# EAGLE schematic Domino Pi No Teardrop (EAGLE 6.5.0)
Domino breakout Board
DATABASE: ./../Common/BOM/Domino_DB.txt; DRAWN: M.STEMPIN; REV: A
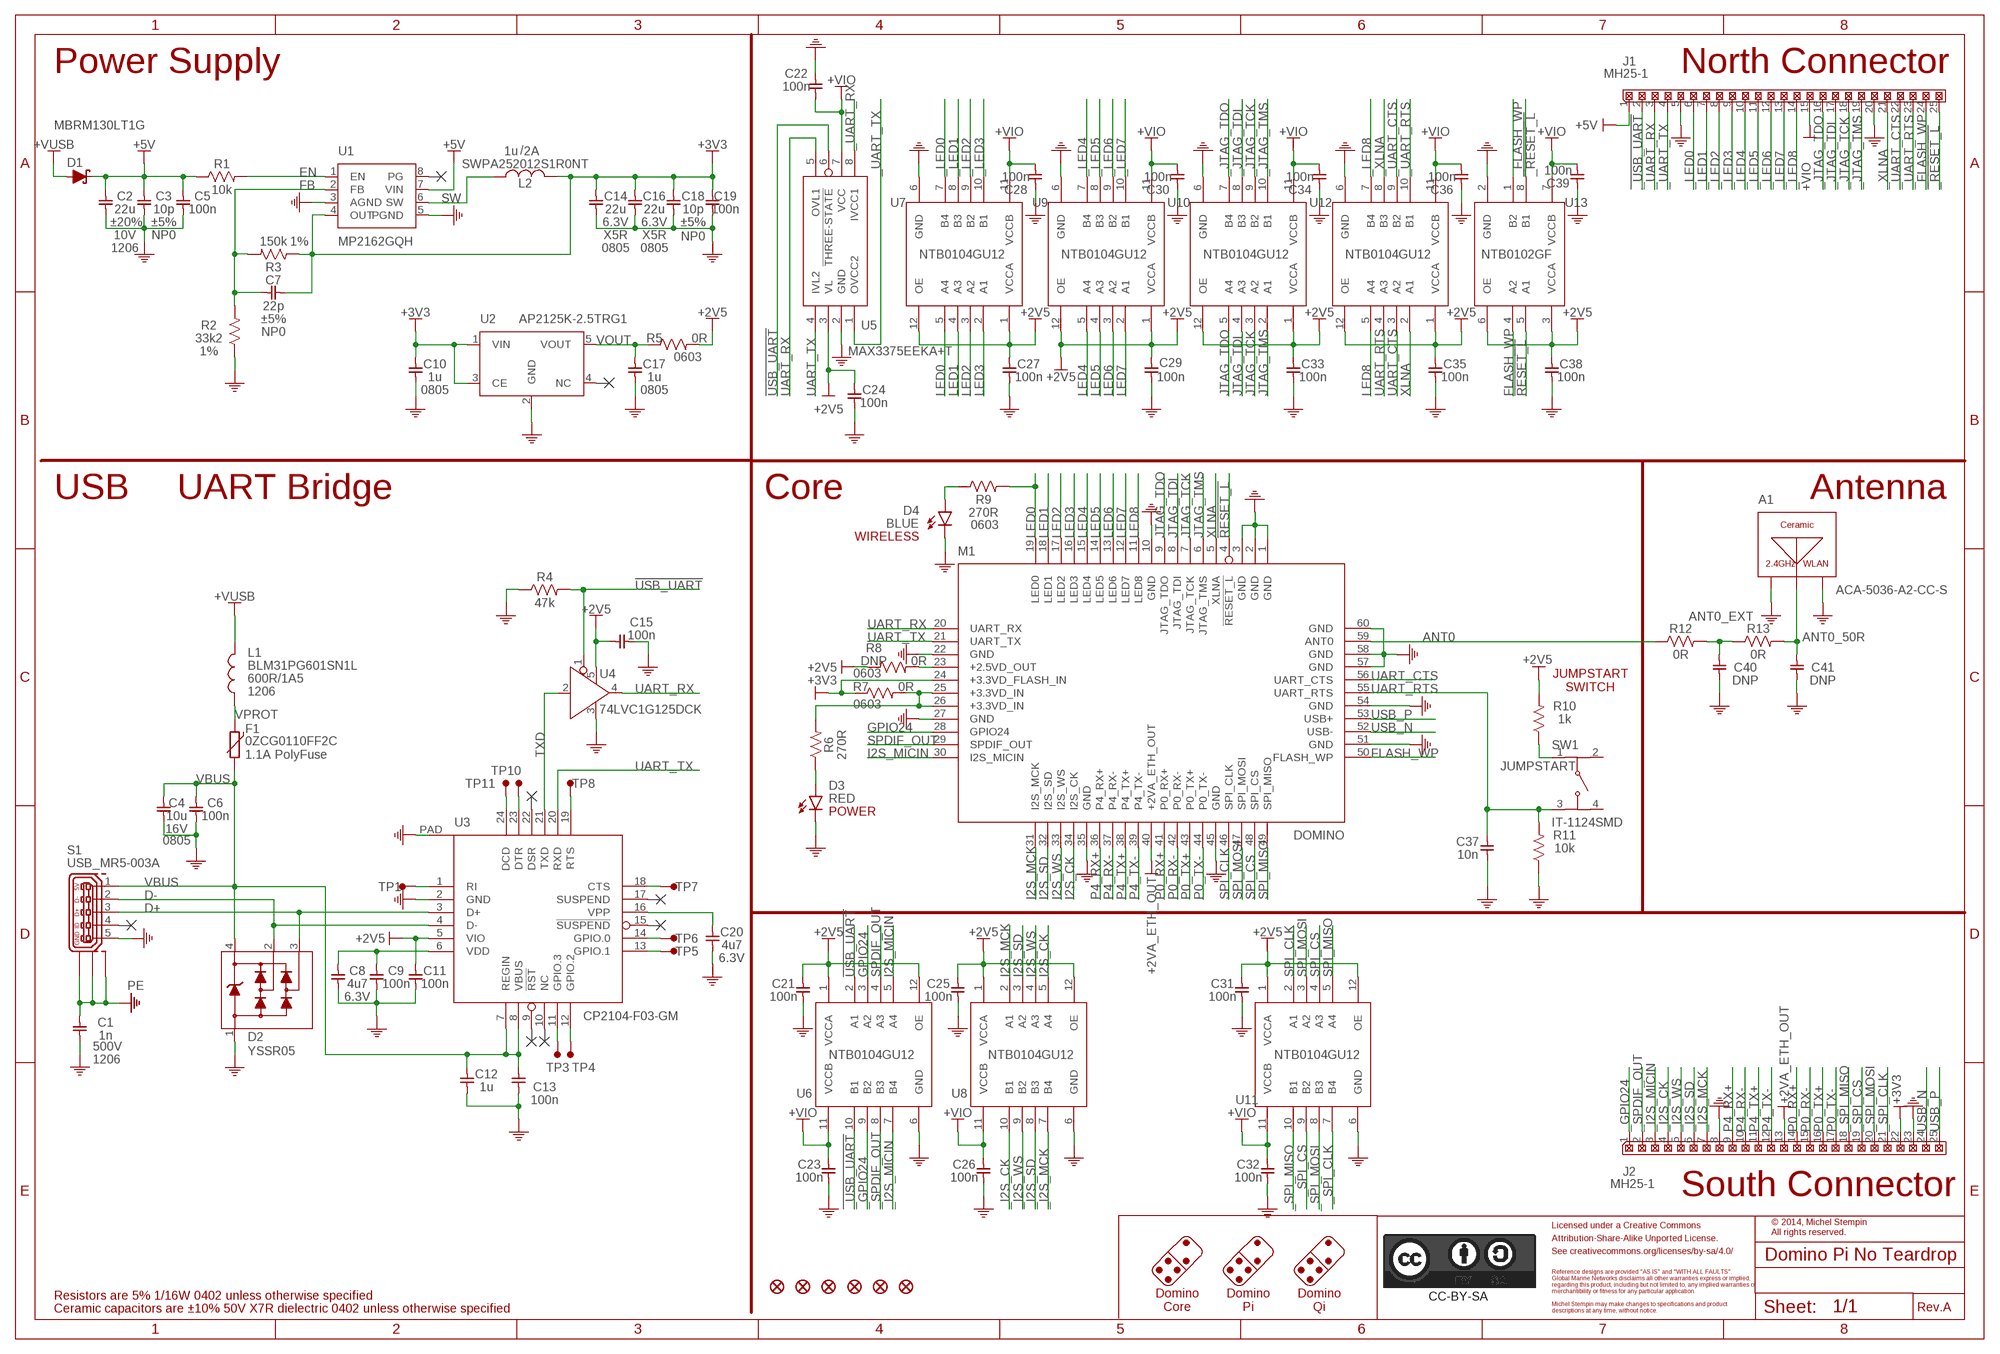
[diagram p0: schematic, sheet 1]
PORT1 (NC): BOM: EXCLUDE
PORT2 (NC): BOM: EXCLUDE
PORT3 (NC): BOM: EXCLUDE
PORT7 (NC): BOM: EXCLUDE
PORT8 (NC): BOM: EXCLUDE
PORT13 (NC): BOM: EXCLUDE
PORT16 (NC): BOM: EXCLUDE
PORT17 (NC): BOM: EXCLUDE

## Parts
A1  ACA-5036-A2-CC-S  [ACA-5036-A2-CC-S]
C1  1n  CAP_1206  [C1206]
C2  22u  CAP_1206  [C1206]
C3  10p  CAP_0402  [C0402]
C4  10u  CAP_0805  [C0805]
C5  100n  CAP_0402  [C0402]
C6  100n  CAP_0402  [C0402]
C7  22p  CAP_0402  [C0402]
C8  4u7  CAP_0402  [C0402]
C9  100n  CAP_0402  [C0402]
C10  1u  CAP_0805  [C0805]
C11  100n  CAP_0402  [C0402]
C12  1u  CAP_0402  [C0402]
C13  100n  CAP_0402  [C0402]
C14  22u  CAP_0805  [C0805]
C15  100n  CAP_0402  [C0402]
C16  22u  CAP_0805  [C0805]
C17  1u  CAP_0805  [C0805]
C18  10p  CAP_0402  [C0402]
C19  100n  CAP_0402  [C0402]
C20  4u7  CAP_0402  [C0402]
C21  100n  CAP_0402  [C0402]
C22  100n  CAP_0402  [C0402]
C23  100n  CAP_0402  [C0402]
C24  100n  CAP_0402  [C0402]
C25  100n  CAP_0402  [C0402]
C26  100n  CAP_0402  [C0402]
C27  100n  CAP_0402  [C0402]
C28  100n  CAP_0402  [C0402]
C29  100n  CAP_0402  [C0402]
C30  100n  CAP_0402  [C0402]
C31  100n  CAP_0402  [C0402]
C32  100n  CAP_0402  [C0402]
C33  100n  CAP_0402  [C0402]
C34  100n  CAP_0402  [C0402]
C35  100n  CAP_0402  [C0402]
C36  100n  CAP_0402  [C0402]
C37  10n  CAP_0402  [C0402]
C38  100n  CAP_0402  [C0402]
C39  100n  CAP_0402  [C0402]
C40  DNP  CAP_0402  [C0402]
C41  DNP  CAP_0402  [C0402]
CC-BY-SA  CC-BY-SA_LOGO  [CC-BY-SA_LOGO]
D1  MBRM130LT1G  [DO-216AA]
D2  YSSR05  [SOT143B]
D3  RED  LED_0603  [LED0603]
D4  BLUE  LED_0603  [LED0603]
F1  0ZCG0110FF2C  [PTC1812]
F2  FIDUCIAL  [FIDUCIAL]
F3  FIDUCIAL  [FIDUCIAL]
F4  FIDUCIAL  [FIDUCIAL]
F5  FIDUCIAL  [FIDUCIAL]
F6  FIDUCIAL  [FIDUCIAL]
F7  FIDUCIAL  [FIDUCIAL]
J1  MH25-1  [MH25-1-0.1]
J2  MH25-1  [MH25-1-0.1]
L1  BLM31PG601SN1L  FB_1206  [FB1206]
L2  SWPA252012S1R0NT  [SWPA252012S]
M1  DOMINO  [DOMINO]
R1  10k  RES_0402  [R0402]
R2  33k2  RES_0402  [R0402]
R3  150k  RES_0402  [R0402]
R4  47k  RES_0402  [R0402]
R5  0R  RES_0603  [R0603]
R6  270R  RES_0402  [R0402]
R7  0R  RES_0603  [R0603]
R8  0R  RES_0603  [R0603]
R9  270R  RES_0603  [R0603]
R10  1k  RES_0402  [R0402]
R11  10k  RES_0402  [R0402]
R12  0R  RES_0402  [R0402]
R13  0R  RES_0402  [R0402]
S1  USB_MR5-003A  [USB_MR5-003A]
SW1  IT-1124SMD  [IT-1124SMD]
TP1  TEST_PAD  [TEST_PAD]
TP3  TEST_PAD  [TEST_PAD]
TP4  TEST_PAD  [TEST_PAD]
TP5  TEST_PAD  [TEST_PAD]
TP6  TEST_PAD  [TEST_PAD]
TP7  TEST_PAD  [TEST_PAD]
TP8  TEST_PAD  [TEST_PAD]
TP10  TEST_PAD  [TEST_PAD]
TP11  TEST_PAD  [TEST_PAD]
U1  MP2162GQH  [QFN-8_2X1.5]
U2  AP2125K-2.5TRG1  [SOT23-5]
U3  CP2104-F03-GM  [QFN-25_4X4]
U4  74LVC1G125DCK  [SC70]
U5  MAX3375EEKA+T  [SOT23-8]
U6  NTB0104GU12  [XQFN-12]
U7  NTB0104GU12  [XQFN-12]
U8  NTB0104GU12  [XQFN-12]
U9  NTB0104GU12  [XQFN-12]
U10  NTB0104GU12  [XQFN-12]
U11  NTB0104GU12  [XQFN-12]
U12  NTB0104GU12  [XQFN-12]
U13  NTB0102GF  [SOT1089]

## Nets
!_RESET_L: J1.25 U13.8(B1)
!_USB_UART: J1.2 U6.10(B1)
!RESET_L: M1.4(!RESET_L) U13.5(A1)
!USB_UART: R4.2 U4.1(!OE) U5.6(!THREE-STATE) U6.2(A1)
+2.5VD_OUT: M1.23(+2.5VD_OUT) R8.2
+2V5: C11.1 C15.2 C21.1 C24.2 C25.1 C27.2 C29.2 C31.1 C33.2 C35.2 C38.2 R5.2 R8.1 R10.2 U3.5(VIO) U4.5(VCC) U5.3(VL) U6.1(VCCA) U6.12(OE) U7.1(VCCA) U7.12(OE) U8.1(VCCA) U8.12(OE) U9.1(VCCA) U9.12(OE) U10.1(VCCA) U10.12(OE) U11.1(VCCA) U11.12(OE) U12.1(VCCA) U12.12(OE) U13.3(VCCA) U13.6(OE)
+2VA_ETH_OUT [Ethernet]: J2.13 M1.40(+2VA_ETH_OUT)
+3.3VD_IN: M1.25(+3.3VD_IN) M1.26(+3.3VD_IN) R6.2 R7.2
+3V3: C7.2 C10.1 C14.1 C16.1 C18.1 C19.1 J2.22 L2.2 M1.24(+3.3VD_FLASH_IN) R3.1 R7.1 U1.4(OUT) U2.1(VIN) U2.3(CE)
+5V: C2.1 C3.1 C5.1 D1.1(C) J1.1 R1.1 U1.7(VIN)
+VIO: C22.1 C23.1 C26.1 C28.1 C30.1 C32.1 C34.1 C36.1 C39.1 J1.15 U5.7(VCC) U6.11(VCCB) U7.11(VCCB) U8.11(VCCB) U9.11(VCCB) U10.11(VCCB) U11.11(VCCB) U12.11(VCCB) U13.7(VCCB)
+VUSB: D1.2(A) L1.1
_FLASH_WP: J1.24 U13.1(B2)
_GPIO24: J2.1 U6.9(B2)
_I2S_CK: J2.4 U8.10(B1)
_I2S_MCK: J2.7 U8.7(B4)
_I2S_MICIN: J2.3 U6.7(B4)
_I2S_SD: J2.6 U8.8(B3)
_I2S_WS: J2.5 U8.9(B2)
_JTAG_TCK: J1.18 U10.9(B2)
_JTAG_TDI: J1.17 U10.8(B3)
_JTAG_TDO: J1.16 U10.7(B4)
_JTAG_TMS: J1.19 U10.10(B1)
_LED0: J1.6 U7.7(B4)
_LED1: J1.7 U7.8(B3)
_LED2: J1.8 U7.9(B2)
_LED3: J1.9 U7.10(B1)
_LED4: J1.10 U9.7(B4)
_LED5: J1.11 U9.8(B3)
_LED6: J1.12 U9.9(B2)
_LED7: J1.13 U9.10(B1)
_LED8: J1.14 U12.7(B4)
_SPDIF_OUT: J2.2 U6.8(B3)
_SPI_CLK: J2.21 U11.7(B4)
_SPI_CS: J2.19 U11.9(B2)
_SPI_MISO: J2.18 U11.10(B1)
_SPI_MOSI: J2.20 U11.8(B3)
_UART_CTS: J1.22 U12.9(B2)
_UART_RTS: J1.23 U12.10(B1)
_UART_RX: J1.3 U5.8(IVCC1)
_UART_TX: J1.4 U5.1(OVCC2)
_XLNA: J1.21 U12.8(B3)
ANT0 [RF]: M1.59(ANT0) R12.1
ANT0_50R: A1.FEED(A) C41.1 R13.2
ANT0_EXT [RF]: C40.1 R12.2 R13.1
BLUE_LED: D4.2(A) R9.1
D+: D2.3 S1.3 U3.3(D+)
D-: D2.2 S1.2 U3.4(D-)
EN: R1.2 U1.1(EN)
FB: C7.1 R2.2 R3.2 U1.2(FB)
FLASH_WP: M1.50(FLASH_WP) U13.4(A2)
GND: A1.GND$1(GND) A1.GND$2(GND) C1.2 C2.2 C3.2 C4.2 C5.2 C6.2 C8.2 C9.2 C10.2 C11.2 C12.2 C13.2 C14.2 C15.1 C16.2 C17.2 C18.2 C19.2 C20.2 C21.2 C22.2 C23.2 C24.1 C25.2 C26.2 C27.1 C28.2 C29.1 C30.2 C31.2 C32.2 C33.1 C34.2 C35.1 C36.2 C37.2 C38.1 C39.2 C40.2 C41.2 D2.1 D3.1(C) D4.1(C) J1.5 J1.20 J2.8 J2.23 M1.1(GND) M1.2(GND) M1.3(GND) M1.10(GND) M1.22(GND) M1.27(GND) M1.35(GND) M1.45(GND) M1.51(GND) M1.54(GND) M1.57(GND) M1.58(GND) M1.60(GND) R2.1 R4.1 R11.1 S1.5 U1.3(AGND) U1.5(PGND) U2.2(GND) U3.2(GND) U3.PAD U4.3(GND) U5.2(GND) U6.6(GND) U7.6(GND) U8.6(GND) U9.6(GND) U10.6(GND) U11.6(GND) U12.6(GND) U13.2(GND)
GPIO24: M1.28(GPIO24) U6.3(A2)
I2S_CK: M1.34(I2S_CK) U8.5(A4)
I2S_MCK: M1.31(I2S_MCK) U8.2(A1)
I2S_MICIN: M1.30(I2S_MICIN) U6.5(A4)
I2S_SD: M1.32(I2S_SD) U8.3(A2)
I2S_WS: M1.33(I2S_WS) U8.4(A3)
JTAG_TCK: M1.7(JTAG_TCK) U10.3(A2)
JTAG_TDI: M1.8(JTAG_TDI) U10.4(A3)
JTAG_TDO: M1.9(JTAG_TDO) U10.5(A4)
JTAG_TMS: M1.6(JTAG_TMS) U10.2(A1)
JUMPSTART: R10.1 SW1.1
LED0: M1.19(LED0) R9.2 U7.5(A4)
LED1: M1.18(LED1) U7.4(A3)
LED2: M1.17(LED2) U7.3(A2)
LED3: M1.16(LED3) U7.2(A1)
LED4: M1.15(LED4) U9.5(A4)
LED5: M1.14(LED5) U9.4(A3)
LED6: M1.13(LED6) U9.3(A2)
LED7: M1.12(LED7) U9.2(A1)
LED8: M1.11(LED8) U12.5(A4)
N$1: D3.2(A) R6.1
N$6: TP1.1(PP) U3.1(RI)
N$8: TP3.1(PP) U3.11(GPIO.3)
N$9: TP4.1(PP) U3.12(GPIO.2)
N$10: TP7.1(PP) U3.18(CTS)
N$12: TP10.1(PP) U3.23(DTR)
N$13: TP11.1(PP) U3.24(DCD)
N$14: TP8.1(PP) U3.19(RTS)
N$15: TP6.1(PP) U3.14(GPIO.0)
N$16: TP5.1(PP) U3.13(GPIO.1)
N$31: C20.1 U3.16(VPP)
P0_RX+ [Ethernet]: J2.14 M1.41(P0_RX+)
P0_RX- [Ethernet]: J2.15 M1.42(P0_RX-)
P0_TX+ [Ethernet]: J2.16 M1.43(P0_TX+)
P0_TX- [Ethernet]: J2.17 M1.44(P0_TX-)
P4_RX+ [Ethernet]: J2.9 M1.36(P4_RX+)
P4_RX- [Ethernet]: J2.10 M1.37(P4_RX-)
P4_TX+ [Ethernet]: J2.11 M1.38(P4_TX+)
P4_TX- [Ethernet]: J2.12 M1.39(P4_TX-)
PE: C1.1 S1.S$1(M0) S1.S$2(M1) S1.S$3(M2)
SPDIF_OUT: M1.29(SPDIF_OUT) U6.4(A3)
SPI_CLK: M1.46(SPI_CLK) U11.2(A1)
SPI_CS: M1.48(SPI_CS) U11.4(A3)
SPI_MISO: M1.49(SPI_MISO) U11.5(A4)
SPI_MOSI: M1.47(SPI_MOSI) U11.3(A2)
SW: L2.1 U1.6(SW)
TXD: U3.21(TXD) U4.2(A)
UART_CTS: M1.56(UART_CTS) U12.3(A2)
UART_RTS: C37.1 M1.55(UART_RTS) R11.2 SW1.3 U12.4(A3)
UART_RX: M1.20(UART_RX) U4.4(Y) U5.5(OVL1)
UART_TX: M1.21(UART_TX) U3.20(RXD) U5.4(IVL2)
USB_N [USB]: J2.24 M1.52(USB-)
USB_P [USB]: J2.25 M1.53(USB+)
VBUS: C4.1 C6.1 C12.1 C13.1 D2.4 F1.2 S1.1 U3.7(REGIN) U3.8(VBUS)
VDD: C8.1 C9.1 U3.6(VDD)
VOUT: C17.1 R5.1 U2.5(VOUT)
VPROT: F1.1 L1.2
XLNA: M1.5(XLNA) U12.2(A1)
Unconnected: S1.4 SW1.2 SW1.4 U1.8(PG) U2.4(NC) U3.9(!RST) U3.10(NC) U3.15(!SUSPEND) U3.17(SUSPEND) U3.22(DSR)

## Notes on the sheet
- Power Supply | North Connector
- /
- USB ⇔ UART Bridge | Core | Antenna
- WIRELESS
- JUMPSTART
  SWITCH
- PolyFuse
- POWER
- South Connector
- Licensed under a Creative Commons
- © 2014, Michel Stempin
  All rights reserved.
- Attribution-Share-Alike Unported License.
- See creativecommons.org/licenses/by-sa/4.0/
- Reference designs are provided "AS IS" and "WITH ALL FAULTS".
- Global Marine Networks disclaims all other warranties express or implied,
- regarding this product, including but not limited to, any implied warranties of
- merchantibility or fitness for any particular application.
- Resistors are 5% 1/16W 0402 unless otherwise specified
- Domino
  Core
- Domino
  Pi
- Domino
  Qi
- Michel Stempin may make changes to specifications and product
- Ceramic capacitors are ±10% 50V X7R dielectric 0402 unless otherwise specified | descriptions at any time, without notice. | Rev.

## Library data of the parts
A1 = Domino:ACA-5036-A2-CC-S: 2.4GHz ISM Band Chip Antenna; PARTNO: ACA-5036-A2-CC-S
C1 = Domino:CAP_: Capacitor; PARTNO: C1206_1n_X7R_10%_CER_500V; SIZE: 1206; TC: X7R; TOL: ±10%; TYPE: CER; VOLT: 500V
C2 = Domino:CAP_: Capacitor; PARTNO: C1206_22u_X7R_20%_CER_10V; SIZE: 1206; TC: X7R; TOL: ±20%; TYPE: CER; VOLT: 10V
C3 C18 = Domino:CAP_: Capacitor; PARTNO: C0402_10p_NP0_5%_CER_50V; SIZE: 0402; TC: NP0; TOL: ±5%; TYPE: CER; VOLT: 50V
C4 = Domino:CAP_: Capacitor; PARTNO: C0805_10u_X7R_10%_CER_16V; SIZE: 0805; TC: X7R; TOL: ±10%; TYPE: CER; VOLT: 16V
C5 C6 C9 C11 C13 C15 C19 C21-C36 C38 C39 = Domino:CAP_: Capacitor; PARTNO: C0402_100n_X7R_10%_CER_50V; SIZE: 0402; TC: X7R; TOL: ±10%; TYPE: CER; VOLT: 50V
C7 = Domino:CAP_: Capacitor; PARTNO: C0402_22p_NP0_5%_CER_50V; SIZE: 0402; TC: NP0; TOL: ±5%; TYPE: CER; VOLT: 50V
C8 C20 = Domino:CAP_: Capacitor; PARTNO: C0402_4u7_X7R_10%_CER_6V3; SIZE: 0402; TC: X7R; TOL: ±10%; TYPE: CER; VOLT: 6.3V
C10 C17 = Domino:CAP_: Capacitor; PARTNO: C0805_1u_X7R_10%_CER_50V; SIZE: 0805; TC: X7R; TOL: ±10%; TYPE: CER; VOLT: 50V
C12 = Domino:CAP_: Capacitor; PARTNO: C0402_1u_X7R_10%_CER_50V; SIZE: 0402; TC: X7R; TOL: ±10%; TYPE: CER; VOLT: 50V
C14 C16 = Domino:CAP_: Capacitor; PARTNO: C0805_22u_X5R_20%_CER_6V3; SIZE: 0805; TC: X5R; TOL: ±20%; TYPE: CER; VOLT: 6.3V
C37 = Domino:CAP_: Capacitor; PARTNO: C0402_10n_X7R_10%_CER_50V; SIZE: 0402; TC: X7R; TOL: ±10%; TYPE: CER; VOLT: 50V
C40 C41 = Domino:CAP_: Capacitor; DNP: T; PARTNO: C0402_DNP; SIZE: 0402
CC-BY-SA = Domino:CC-BY-SA_LOGO: Attribution-Share-Alike Unported License See creativecommons.org/licenses/by-sa/3.0/ for details.; BOM: EXCLUDE
D1 = Domino:MBRM130: Schottky Barrier Rectifier, 1A, 30V; PARTNO: MBRM130LT1G; RATE: 1A; VOLT: 30V
D2 = Domino:YSSR05: Ultra low capacitance double rail-to-rail ESD protection diode; PARTNO: YSSR05; RATE: 300W; VOLT: 5V
D3 = Domino:LED_: LED; PARTNO: LED0603-RED
D4 = Domino:LED_: LED; PARTNO: LED0603-BLUE
F1 = Domino:0ZCG: Bel 0ZCG Series Surface Mount PTC; PARTNO: 0ZCG0110FF2C; RATE: 1.1A; VOLT: 8V
F2-F7 = Domino:FIDUCIAL: Fiducial Mark Copyright © 2012, Michel Stempin, All rights reserved Licenced under Creative Commons CC BY-SA 3.0 <http://creativecommons.org/licenses/by-sa/3.0/deed.en> license.; BOM: EXCLUDE
J1 J2 = Domino:MH25-1: 25x1 Pin Male Header; PARTNO: MH25-1-0.1
L1 = Domino:FB_: Ferrite Bead; OPT: 600R/1A5; PARTNO: BLM31PG601SN1L; SIZE: 1206
L2 = Domino:SWPA252012S*?: 2.0 x 1.5 mm Footprint 1.2mm Height Shielded Inductor; INDUCTANCE: 1u; PARTNO: SWPA252012SMT; RATE: 2A; TOL: ±30%
M1 = Domino:DOMINO: GL-Connect Domino WiFi Module; PARTNO: DOMINO-CORE
R1 R11 = Domino:RES_: Resistor; PARTNO: R0402_10k_5%_62.5mW; RATE: 62.5mW; SIZE: 0402; TOL: 5%
R2 = Domino:RES_: Resistor; PARTNO: R0402_33k2_1%_62.5mW; RATE: 62.5mW; SIZE: 0402; TOL: 1%
R3 = Domino:RES_: Resistor; PARTNO: R0402_150k_1%_62.5mW; RATE: 62.5mW; SIZE: 0402; TOL: 1%
R4 = Domino:RES_: Resistor; PARTNO: R0402_47k_5%_62.5mW; RATE: 62.5mW; SIZE: 0402; TOL: 5%
R5 R7 = Domino:RES_: Resistor; PARTNO: R0603_0R_5%_125mW; RATE: 125mW; SIZE: 0603; TOL: 5%
R6 = Domino:RES_: Resistor; PARTNO: R0603_270R_5%_125mW; RATE: 125mW; SIZE: 0402; TOL: 5%
R8 = Domino:RES_: Resistor; DNP: T; PARTNO: R0603_0R_5%_125mW; RATE: 125mW; SIZE: 0603; TOL: 5%
R9 = Domino:RES_: Resistor; PARTNO: R0603_270R_5%_125mW; RATE: 125mW; SIZE: 0603; TOL: 5%
R10 = Domino:RES_: Resistor; PARTNO: R0402_1k_5%_62.5mW; RATE: 62.5mW; SIZE: 0402; TOL: 5%
R12 R13 = Domino:RES_: Resistor; PARTNO: R0402_0R_5%_62.5mW; RATE: 62.5mW; SIZE: 0402; TOL: 5%
S1 = Domino:USB_MR5-003: Micro USB Type B Receptacle, 3 Shield Pins; PARTNO: USB MR5-003A
SW1 = Domino:IT-1124SMD: SPST Tact Switch; PARTNO: IT-1124SMD
TP1 TP3-TP8 TP10 TP11 = Domino:TEST_PAD: Test Pad; BOM: EXCLUDE
U1 = Domino:MP2162: 2A, 6V, 1.5MHz Synchronous Step-Down Switcher; PARTNO: MP2162GQH
U2 = Domino:AP2125?*: 300mA High-Speed, Extremely Low Noise CMOS LDO Regulator; PARTNO: AP2125K-2.5TRG1; RATE: 0.3A; VOLT: 2.5V
U3 = Domino:CP2104-: Single-Chip USB-to-UART Bridge; PARTNO: CP2104-F03-GM
U4 = Domino:74*1G125: Single Bus Buffer Gate With 3-State Output; PARTNO: 74LVC1G125DCK
U5 = Domino:MAX3375E: Dual Low-Voltage Level Translators; PARTNO: MAX3375EEKA+T
U6-U12 = Domino:NTB0104: Dual supply translating transceiver; auto direction sensing; 3-state; PARTNO: NTB0104GU12
U13 = Domino:NTB0102: Dual supply translating transceiver; auto direction sensing; 3-state; PARTNO: NTB0102GF

## Net classes
1 USB: width 0.254 mm, clearance 0.127 mm
2 RF: width 0.66 mm, clearance 0.152 mm
3 Ethernet: width 0.178 mm, clearance 0.152 mm to class 0, clearance 0.127 mm